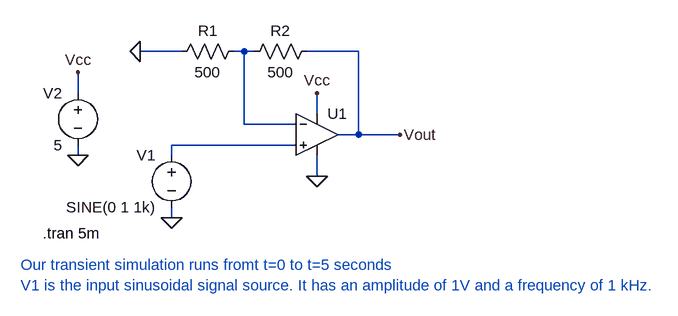
[diagram p0: schematic trans_sim.asc]
trans_sim.asc, the LTspice schematic file:
Version 4
SHEET 1 880 680
WIRE 0 -16 -64 -16
WIRE 96 -16 80 -16
WIRE 112 -16 96 -16
WIRE 272 -16 192 -16
WIRE -160 48 -160 16
WIRE 208 80 208 48
WIRE 96 96 96 -16
WIRE 176 96 96 96
WIRE 272 112 272 -16
WIRE 272 112 240 112
WIRE 336 112 272 112
WIRE 176 128 -16 128
WIRE -160 144 -160 128
WIRE -16 144 -16 128
WIRE 208 176 208 144
WIRE -16 240 -16 224
FLAG -64 -16 0
FLAG 208 176 0
FLAG 336 112 Vout
FLAG 208 48 Vcc
FLAG -16 240 0
FLAG -160 144 0
FLAG -160 16 Vcc
SYMBOL voltage -16 128 M0
WINDOW 123 0 0 Left 2
WINDOW 39 0 0 Left 2
SYMATTR InstName V1
SYMATTR Value SINE(0 1 1k)
SYMBOL Opamps\\UniversalOpamp2 208 112 R0
SYMATTR InstName U1
SYMBOL res 208 -32 R90
WINDOW 0 0 56 VBottom 2
WINDOW 3 32 56 VTop 2
SYMATTR InstName R2
SYMATTR Value 500
SYMBOL res 96 -32 R90
WINDOW 0 0 56 VBottom 2
WINDOW 3 32 56 VTop 2
SYMATTR InstName R1
SYMATTR Value 500
SYMBOL voltage -160 32 M0
WINDOW 123 0 0 Left 2
WINDOW 39 0 0 Left 2
SYMATTR InstName V2
SYMATTR Value 5
TEXT -214 264 Left 2 !.tran 5m
TEXT -248 312 Left 2 ;Our transient simulation runs fromt t=0 to t=5 seconds
TEXT -248 344 Left 2 ;V1 is the input sinusoidal signal source. It has an amplitude of 1V and a frequency of 1 kHz.

The netlist it stands for:
* trans_sim.asc
V1 N002 0 SINE(0 1 1k)
XU1 N002 N001 Vcc 0 Vout level.2 Avol=1Meg GBW=10Meg Slew=10Meg ilimit=25m rail=0 Vos=0 phimargin=45 en=0 enk=0 in=0 ink=0 Rin=500Meg  ; pins IN+ IN- V+ V- OUT
R2 Vout N001 500
R1 N001 0 500
V2 Vcc 0 5
.tran 5m
* Our transient simulation runs fromt t=0 to t=5 seconds
* V1 is the input sinusoidal signal source. It has an amplitude of 1V and a frequency of 1 kHz.
.lib UniversalOpamps2.sub
.backanno
.end